# Altium schematic sheet OS-2024-Badge-Schematic-REV0.SchDoc
size A3
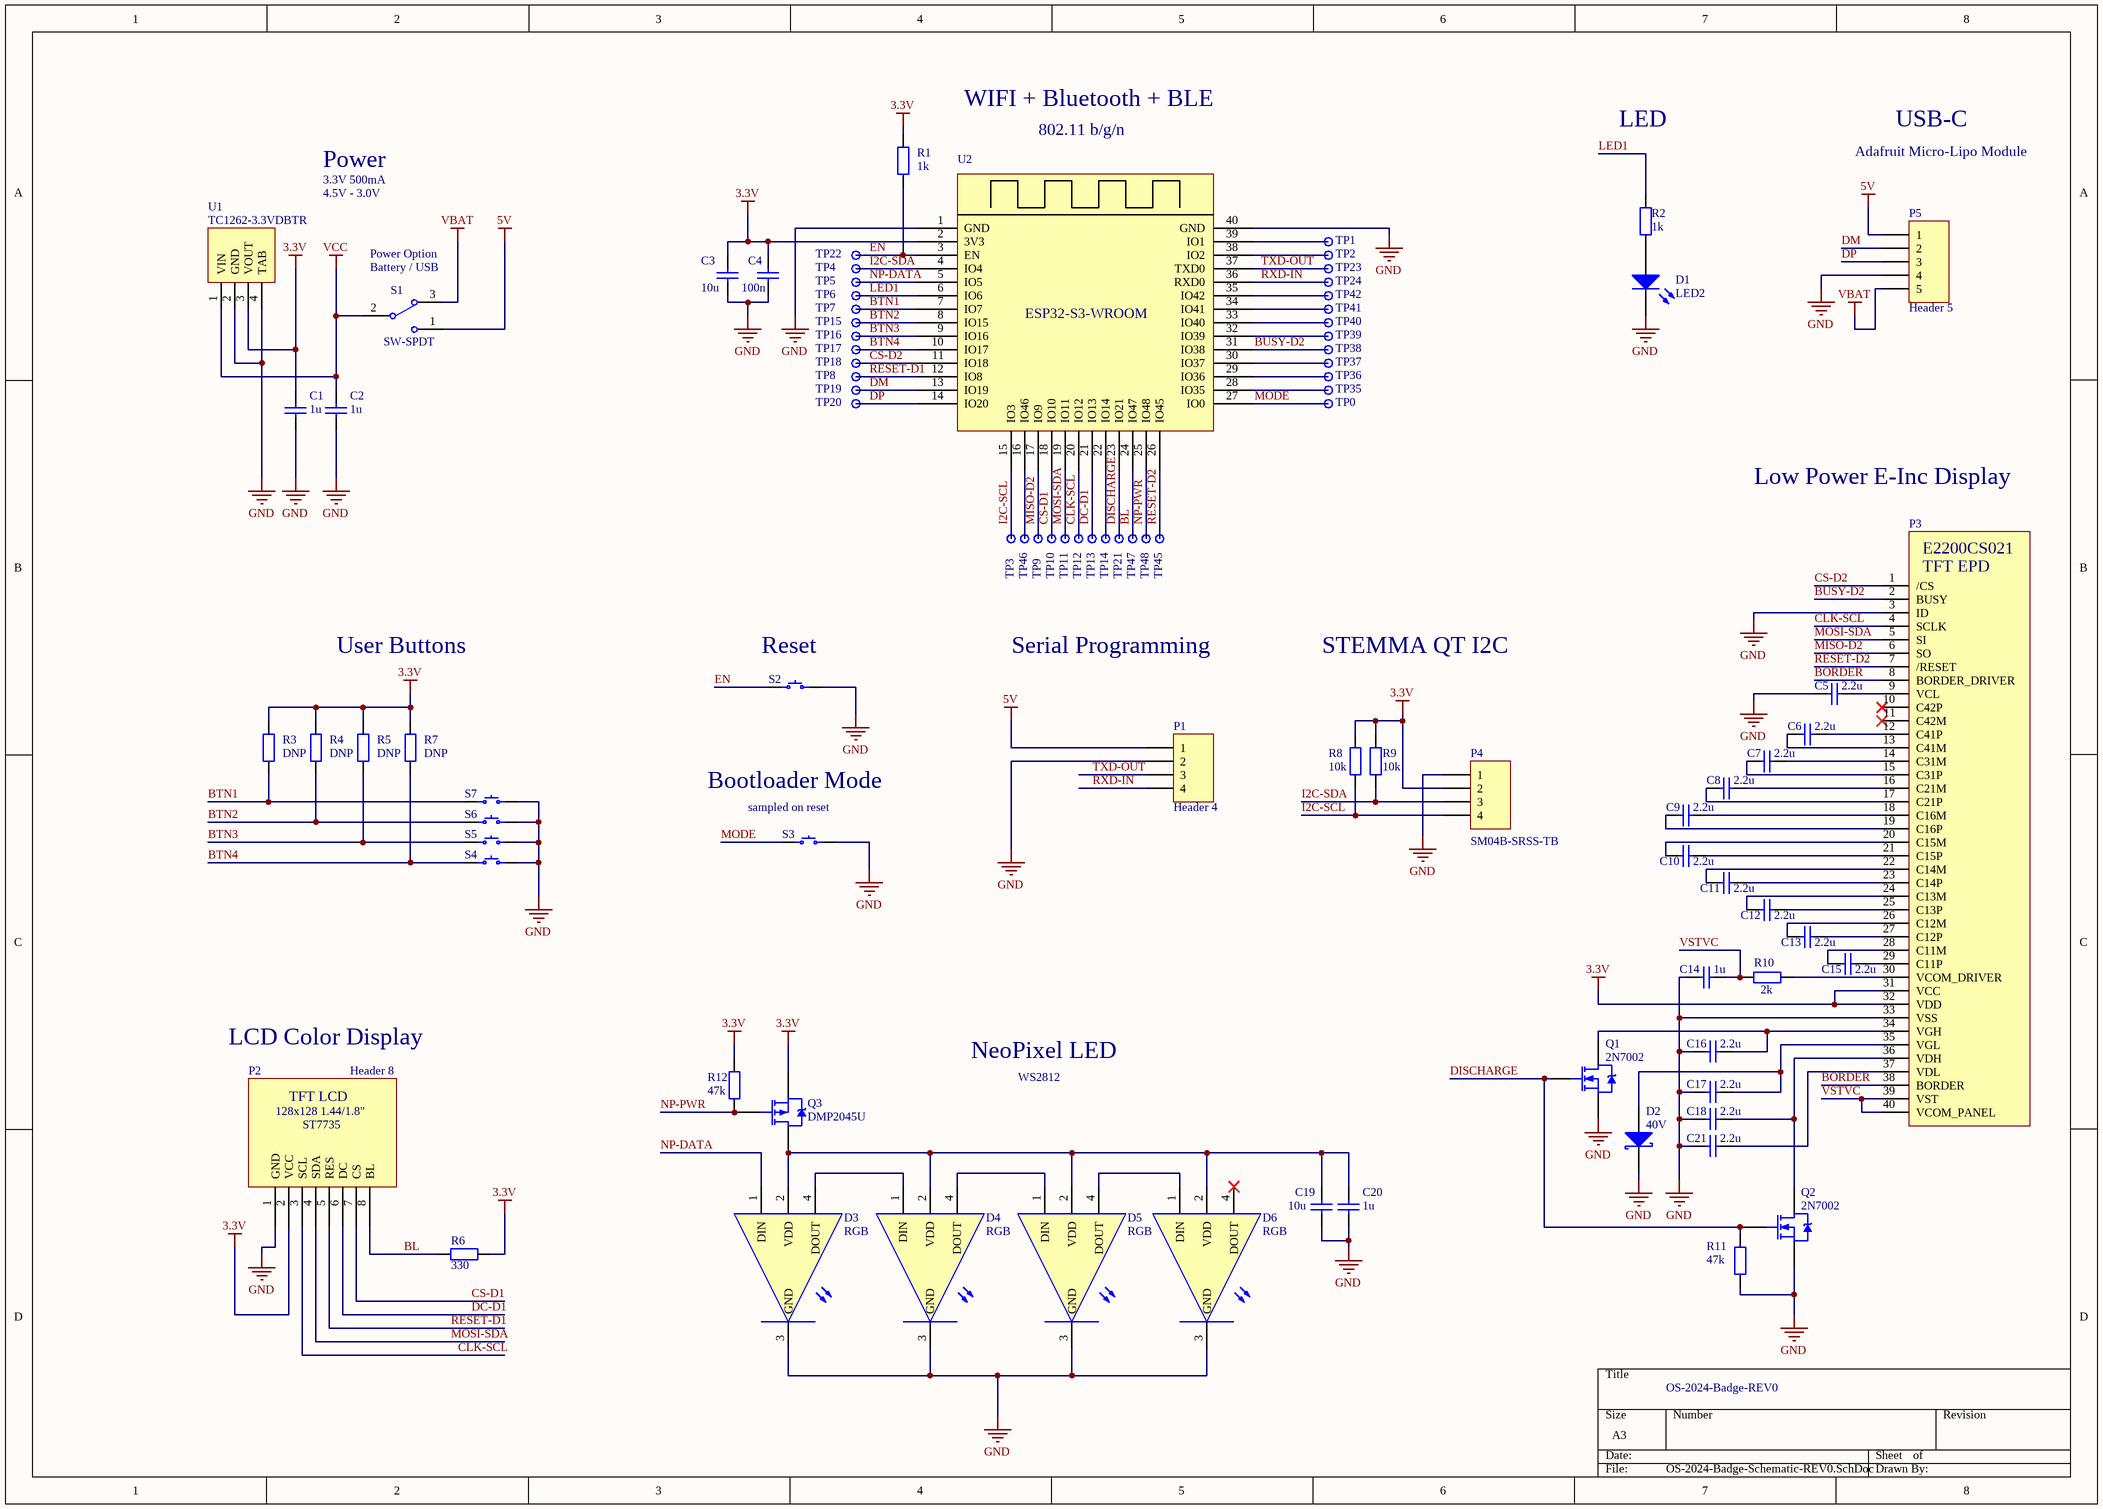
[diagram p0: OS-2024-Badge-Schematic-REV0.SchDoc]

## Parts
C1  1u  [0603C]
C2  1u  [0603C]
C3  10u  [0603C]
C4  100n  [0603C]
C5  2.2u  [0603C]
C6  2.2u  [0603C]
C7  2.2u  [0603C]
C8  2.2u  [0603C]
C9  2.2u  [0603C]
C10  2.2u  [0603C]
C11  2.2u  [0603C]
C12  2.2u  [0603C]
C13  2.2u  [0603C]
C14  1u  [0603C]
C15  2.2u  [0603C]
C16  2.2u  [0603C]
C17  2.2u  [0603C]
C18  2.2u  [0603C]
C19  10u  [0603C]
C20  1u  [0603C]
C21  2.2u  [0603C]
D1  LED2  [0603LED]
D2  40V  [SOD-123FL]
D3  RGB  [COM-12986]
D4  RGB  [COM-12986]
D5  RGB  [COM-12986]
D6  RGB  [COM-12986]
P1  Header 4  [HDR1X4]
P2  Header 8  [TFT144SPI]
P3  CONN FPC TOP 40POS 0.5MM R/A  [AMPHENOL_62684-402100ALF]  (value not drawn)
P4  SM04B-SRSS-TB  [SM04B-TRSS-TB]
P5  Header 5  [Micro-Lipo-USBC]
Q1  2N7002  [SOT-23-N]
Q2  2N7002  [SOT-23-N]
Q3  DMP2045U  [SOT-23-P]
R1  1k  [0603R]
R2  1k  [0603R]
R3  DNP  [0603R]
R4  DNP  [0603R]
R5  DNP  [0603R]
R6  330  [0603R]
R7  DNP  [0603R]
R8  10k  [0603R]
R9  10k  [0603R]
R10  2k  [0603R]
R11  47k  [0603R]
R12  47k  [0603R]
S1  SW-SPDT  [HDR1X3]
S2  SPST-NO  [PTS636SL43LFS]  (value not drawn)
S3  SPST-NO  [PTS636SL43LFS]  (value not drawn)
S4  SPST-NO  [PTS636SL43LFS]  (value not drawn)
S5  SPST-NO  [PTS636SL43LFS]  (value not drawn)
S6  SPST-NO  [PTS636SL43LFS]  (value not drawn)
S7  SPST-NO  [PTS636SL43LFS]  (value not drawn)
TP0  Test Point  [Testpoint]  (value not drawn)
TP1  Test Point  [Testpoint]  (value not drawn)
TP2  Test Point  [Testpoint]  (value not drawn)
TP3  Test Point  [Testpoint]  (value not drawn)
TP4  Test Point  [Testpoint]  (value not drawn)
TP5  Test Point  [Testpoint]  (value not drawn)
TP6  Test Point  [Testpoint]  (value not drawn)
TP7  Test Point  [Testpoint]  (value not drawn)
TP8  Test Point  [Testpoint]  (value not drawn)
TP9  Test Point  [Testpoint]  (value not drawn)
TP10  Test Point  [Testpoint]  (value not drawn)
TP11  Test Point  [Testpoint]  (value not drawn)
TP12  Test Point  [Testpoint]  (value not drawn)
TP13  Test Point  [Testpoint]  (value not drawn)
TP14  Test Point  [Testpoint]  (value not drawn)
TP15  Test Point  [Testpoint]  (value not drawn)
TP16  Test Point  [Testpoint]  (value not drawn)
TP17  Test Point  [Testpoint]  (value not drawn)
TP18  Test Point  [Testpoint]  (value not drawn)
TP19  Test Point  [Testpoint]  (value not drawn)
TP20  Test Point  [Testpoint]  (value not drawn)
TP21  Test Point  [Testpoint]  (value not drawn)
TP22  Test Point  [Testpoint]  (value not drawn)
TP23  Test Point  [Testpoint]  (value not drawn)
TP24  Test Point  [Testpoint]  (value not drawn)
TP35  Test Point  [Testpoint]  (value not drawn)
TP36  Test Point  [Testpoint]  (value not drawn)
TP37  Test Point  [Testpoint]  (value not drawn)
TP38  Test Point  [Testpoint]  (value not drawn)
TP39  Test Point  [Testpoint]  (value not drawn)
TP40  Test Point  [Testpoint]  (value not drawn)
TP41  Test Point  [Testpoint]  (value not drawn)
TP42  Test Point  [Testpoint]  (value not drawn)
TP45  Test Point  [Testpoint]  (value not drawn)
TP46  Test Point  [Testpoint]  (value not drawn)
TP47  Test Point  [Testpoint]  (value not drawn)
TP48  Test Point  [Testpoint]  (value not drawn)
U1  TC1262-3.3VDBTR  [SOT-223-2]
U2  ESP32-S3-WROOM  [ESP32-S3-WROOM-1-N16R8]  (value not drawn)

## Nets
3.3V: C1.1 C3.1 C4.1 P2.2(VCC) P3.31(VCC) P3.32(VDD) P4.2 Q3.S R1.2 R3.2 R4.2 R5.2 R6.2 R7.2 R8.1 R9.1 R12.1 U1.3(VOUT) U2.2(3V3)
5V: P1.1 P5.1 S1.1
GND: C1.2 C2.2 C3.2 C4.2 C5.1 C14.1 C16.2 C17.2 C18.2 C19.2 C20.2 C21.2 D1.2(K) D2.1(K) D3.3(GND) D4.3(GND) D5.3(GND) D6.3(GND) P1.2 P2.1(GND) P3.3(ID) P3.33(VSS) P4.1 P5.4 Q1.2(S) Q2.2(S) R11.2 S2.2 S3.2 S4.2 S5.2 S6.2 S7.2 U1.2(GND) U1.4(TAB) U2.1(GND) U2.40(GND)
VBAT: P5.5 S1.3
VCC: C2.1 S1.2 U1.1(VIN)
BL: P2.8(BL) R6.1 TP47.1 U2.24(IO47)
BORDER: P3.8(BORDER_DRIVER) P3.38(BORDER)
BTN1: R3.1 S7.1 TP7.1 U2.7(IO7)
BTN2: R4.1 S6.1 TP15.1 U2.8(IO15)
BTN3: R5.1 S5.1 TP16.1 U2.9(IO16)
BTN4: R7.1 S4.1 TP17.1 U2.10(IO17)
BUSY-D2: P3.2(BUSY) TP38.1 U2.31(IO38)
CLK-SCL: P2.3(SCL) P3.4(SCLK) TP12.1 U2.20(IO12)
CS-D1: P2.7(CS) TP10.1 U2.18(IO10)
CS-D2: P3.1(/CS) TP18.1 U2.11(IO18)
DC-D1: P2.6(DC) TP13.1 U2.21(IO13)
DISCHARGE: Q1.1(G) Q2.1(G) R11.1 TP21.1 U2.23(IO21)
DM: P5.2 TP19.1 U2.13(IO19)
DP: P5.3 TP20.1 U2.14(IO20)
EN: R1.1 S2.1 TP22.1 U2.3(EN)
I2C-SCL: P4.4 R8.2 TP3.1 U2.15(IO3)
I2C-SDA: P4.3 R9.2 TP4.1 U2.4(IO4)
LED1: R2.1 TP6.1 U2.6(IO6)
MISO-D2: P3.6(SO) TP9.1 U2.17(IO9)
MODE: S3.1 TP0.1 U2.27(IO0)
MOSI-SDA: P2.4(SDA) P3.5(SI) TP11.1 U2.19(IO11)
NP-DATA: D3.1(DIN) TP5.1 U2.5(IO5)
NP-PWR: Q3.G R12.2 TP48.1 U2.25(IO48)
RESET-D1: P2.5(RES) TP8.1 U2.12(IO8)
RESET-D2: P3.7(/RESET) TP45.1 U2.26(IO45)
RXD-IN: P1.4 TP24.1 U2.36(RXD0)
TXD-OUT: P1.3 TP23.1 U2.37(TXD0)
VSTVC: C14.2 P3.39(VST) P3.40(VCOM_PANEL) R10.1
NetC5_2: C5.2 P3.9(VCL)
NetC6_1: C6.1 P3.12(C41P)
NetC6_2: C6.2 P3.13(C41M)
NetC7_1: C7.1 P3.14(C31M)
NetC7_2: C7.2 P3.15(C31P)
NetC8_1: C8.1 P3.16(C21M)
NetC8_2: C8.2 P3.17(C21P)
NetC9_1: C9.1 P3.18(C16M)
NetC9_2: C9.2 P3.19(C16P)
NetC10_1: C10.1 P3.21(C15P)
NetC10_2: C10.2 P3.20(C15M)
NetC11_1: C11.1 P3.23(C14P)
NetC11_2: C11.2 P3.22(C14M)
NetC12_1: C12.1 P3.25(C13P)
NetC12_2: C12.2 P3.24(C13M)
NetC13_1: C13.1 P3.27(C12P)
NetC13_2: C13.2 P3.26(C12M)
NetC15_1: C15.1 P3.29(C11P)
NetC15_2: C15.2 P3.28(C11M)
NetC16_1: C16.1 P3.34(VGH) Q1.3(D)
NetC17_1: C17.1 D2.2(A) P3.35(VGL)
NetC18_1: C18.1 P3.36(VDH) Q2.3(D)
NetC19_1: C19.1 C20.1 D3.2(VDD) D4.2(VDD) D5.2(VDD) D6.2(VDD) Q3.D
NetC21_1: C21.1 P3.37(VDL)
NetD1_1: D1.1(A) R2.2
NetD3_4: D3.4(DOUT) D4.1(DIN)
NetD4_4: D4.4(DOUT) D5.1(DIN)
NetD5_4: D5.4(DOUT) D6.1(DIN)
NetP3_30: P3.30(VCOM_DRIVER) R10.2
NetTP1_1: TP1.1 U2.39(IO1)
NetTP2_1: TP2.1 U2.38(IO2)
NetTP14_1: TP14.1 U2.22(IO14)
NetTP35_1: TP35.1 U2.28(IO35)
NetTP36_1: TP36.1 U2.29(IO36)
NetTP37_1: TP37.1 U2.30(IO37)
NetTP39_1: TP39.1 U2.32(IO39)
NetTP40_1: TP40.1 U2.33(IO40)
NetTP41_1: TP41.1 U2.34(IO41)
NetTP42_1: TP42.1 U2.35(IO42)
NetTP46_1: TP46.1 U2.16(IO46)

Not connected (* = marked no-connect by the designer): D6 4(DOUT)*; P3 10(C42P)* 11(C42M)*

## Notes on the sheet
- WIFI + Bluetooth + BLE
- Power
- 3.3V 500mA
- 802.11 b/g/n
- LED
- Adafruit Micro-Lipo Module
- USB-C
- 4.5V - 3.0V
- (near S1) Power Option
- (near S1) Battery / USB
- Low Power E-Inc Display
- User Buttons
- (near S2) Reset
- Serial Programming
- STEMMA QT I2C
- (near S3) Bootloader Mode
- (near S3) sampled on reset
- LCD Color Display
- NeoPixel LED
- WS2812
- OS-2024-Badge-REV0
- (in symbol Display_128_128) TFT LCD; 128x128 1.44/1.8"; ST7735
- (in symbol Header 40) E2200CS021; TFT EPD

## Library data of the parts
C1 C2 C14 C20 = Cap: CAP CER 1UF 50V Z5U 0603; Manufacturer: Murata Electronics North America; Manufacturer Part Number: GRT188R61H105ME13D; Distributor: Digikey; Distributor Part Number: 490-12331-1-ND
C3 C19 = Cap: CAP CER 10UF 10V X5R 0603; Manufacturer: Murata Electronics North America; Manufacturer Part Number: GRN188R61A106KE69J; Distributor: Digikey; Distributor Part Number: 490-14372-1-ND
C4 = Cap: CAP CER .1UF 10V X7R 0603; Manufacturer: Wurth Electronics Inc.; Manufacturer Part Number: 885012206020; Distributor: Digikey; Distributor Part Number: 732-7939-1-ND
C5-C13 C15-C18 C21 = Cap: CAP CER 2.2UF 10V X5R 0603; Manufacturer: Cal-Chip Electronics, Inc.; Manufacturer Part Number: GMC10X5R225M10NT; Distributor: Digikey; Distributor Part Number: 2571-GMC10X5R225M10NTTR-ND
D1 = LED2: LED ORANGE CLEAR CHIP SMD; Manufacturer: Kingbright; Manufacturer Part Number: AOT1608SECK; Distributor: Digi-Key; Distributor Part Number: 754-1120-1-ND
D2 = Diode BAT17: DIODE SCHOTTKY 40V 2A SOD123FL; Manufacturer: Panjit International Inc.; Manufacturer Part Number: SS2040FL_R1_00001; Distributor: Digikey; Distributor Part Number: 3757-SS2040FL_R1_00001CT-ND
D3-D6 = LED2_1: ADDRESS LED DISCR SERIAL RGB; Manufacturer: Spark Fun; Distributor: Digi-Key; Distributor Part Number: 1568-1213-ND; Manufacturer Part Number: COM-12986
P1 = Header 4: Header, 4-Pin; Manufacturer: Wurth Elektronik; Manufacturer Part Number: 61300411121; Distributor: Digi-Key; Distributor Part Number: 732-5317-ND
P2 = Display_128_128: 1.44" 128x128 65K SPI Full Color TFT LCD Display Module ST7735 OLED for Arduino; Manufacturer: Mill-Max; Manufacturer Part Number: 7406-0-15-15-18-27-10-0; MFG-Comment: 8 each for P2; Old Header: S7006-ND; Distributor: DigiKey; Distributor Part Number: ED90446-ND
P3 = Header 40: Manufacturer: Amphenol ICC (FCI); Manufacturer Part Number: 62684-402100ALF; Distributor: Digi-Key; Distributor Part Number: 609-1200-1-ND
P4 = Header 5: CONN HEADER SMD R/A 4POS 1MM; Manufacturer: JST Sales America Inc.; Distributor: Digikey; Distributor Part Number: 455-SM04B-SRSS-TBCT-ND; Manufacturer Part Number: SM04B-SRSS-TB
P5 = Header 5: Adafruit Micro-Lipo Charger for LiPoly Batt with USB Type C Jack; Manufacturer: Mill-Max; Manufacturer Part Number: 7406-0-15-15-18-27-10-0; MFG-Comment: 5 each for P5; Distributor: Digikey; Distributor Part Number: ED90446-ND
Q1 Q2 = NMOS-2: MOSFET N-CH 60V 280MA SOT23-3; Manufacturer: Diotec Semiconductor; Distributor: Digikey; Distributor Part Number: 4878-2N7002CT-ND; Manufacturer Part Number: 2N7002
Q3 = PMOS-2: P-Channel Power MOSFET; Manufacturer: Diodes Incorporated; Manufacturer Part Number: DMP2045U-7; Distributor: Digikey; Distributor Part Number: DMP2045U-7DICT-ND
R1 R2 = Res2: RES SMD 1K OHM 5% 1/10W 0603; Manufacturer: Yageo; Manufacturer Part Number: RC0603JR-071KL; Value: 1k; Distributor: Digikey; Distributor Part Number: 311-1.0KGRCT-ND
R3-R5 R7 = Res2: RES SMD 1K OHM 5% 1/10W 0603; Manufacturer: NONE; MFG-Comment: DO NOT POPULATE; Value: DNP; Manufacturer Part Number: NONE; Distributor: NONE; Distributor Part Number: NONE
R6 = Res2: RES SMD 330 OHM 5% 1/10W 0603; Manufacturer: Yageo; Manufacturer Part Number: RC0603JR-07330RL; Value: 330; Distributor: Digikey; Distributor Part Number: 311-330GRCT-ND
R8 R9 = Res2: RES SMD 47K OHM 5% 1/10W 0603; Manufacturer: Yageo; Manufacturer Part Number: RC0603JR-0710KL; Value: 10k; Distributor: Digikey; Distributor Part Number: 311-10KGRCT-ND
R10 = Res2: RES SMD 1K OHM 5% 1/10W 0603; Manufacturer: Yageo; Manufacturer Part Number: RC0603JR-072KL; Value: 2k; Distributor: Digikey; Distributor Part Number: 311-2.0KGRCT-ND
R11 R12 = Res2: RES SMD 47K OHM 5% 1/10W 0603; Manufacturer: Yageo; Manufacturer Part Number: RC0603JR-0747KL; Value: 47k; Distributor: Digikey; Distributor Part Number: 311-47KGRCT-ND
S1 = SW-SPDT: SPDT Subminiature Toggle Switch, Right Angle Mounting, Vertical Actuation; Manufacturer: E-Switch; Manufacturer Part Number: EG1903-ND; Distributor Part Number: EG1903-ND; Distributor: Digikey
S2-S7 = SPST-NO 2 PIN: Tactile Switch SPST-NO Top Actuated Through Hole; Manufacturer: C&K; Manufacturer Part Number: PTS636 SL43 LFS; Distributor: Digikey; Distributor Part Number: CKN12301-ND
TP0-TP24 TP35-TP42 TP45-TP48 = TestPoint: Test Point Do Not Populate; Manufacturer: NONE; MFG-Comment: DO NOT POPULATE!; Distributor: NONE; Distributor Part Number: NONE; Manufacturer Part Number: NONE
U1 = Header 3: IC REG LINEAR 3.3V 500mA SOT223-3; Manufacturer: Microchip Technology; Manufacturer Part Number: TC1262-3.3VDBTR; Distributor: Digikey; Distributor Part Number: TC1262-3.3VDBCT-ND
U2 = ESP32-S3-WROOM: Bluetooth, WiFi 802.11b/g/n, Bluetooth v5.0 Transceiver Module 2.4GHz PCB Trace Surface Mount; Manufacturer: Espressif Systems; MFG-Comment: No Solder paste on large GND pad, No solder paste on extra pads!!  See OS-2020-Badge-REV0-Assembly-Revised.pdf; Distributor: Digikey; Manufacturer Part Number: ESP32-S3-WROOM-1-N16R8; Distributor Part Number: 1965-ESP32-S3-WROOM-1-N16R8TR-ND